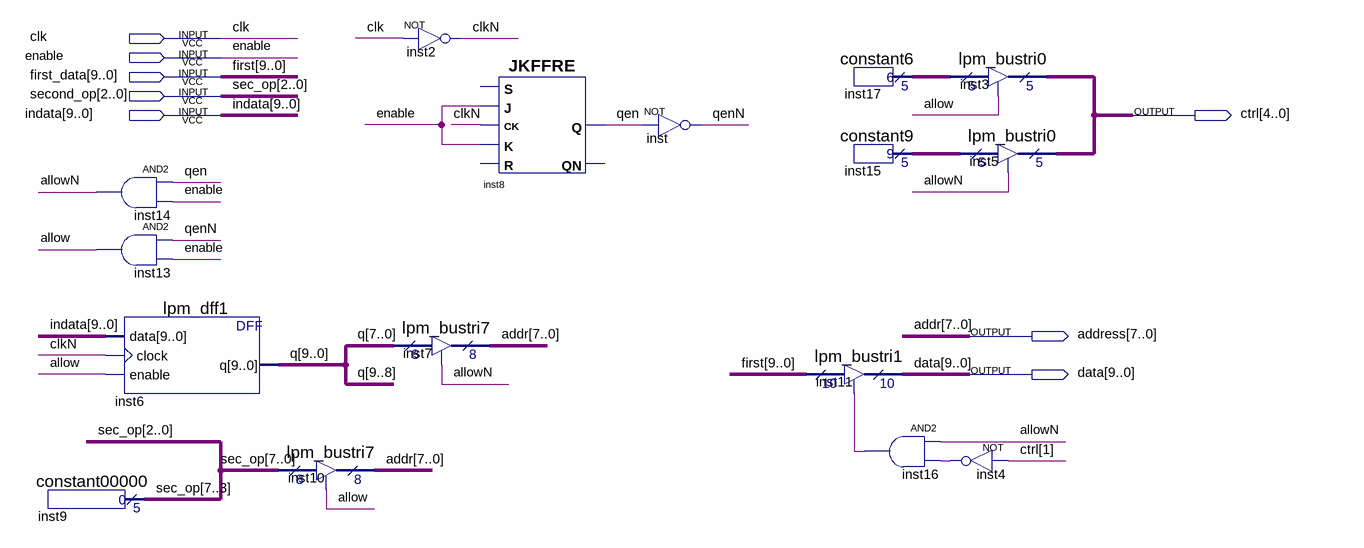
[diagram p0: schematic sheet]
// Quartus schematic R-M_exec.bdf as structural Verilog: 16 symbols, 8 pins
module \R-M_exec  (
  input  clk,
  input  enable,
  input  [9:0] first_data,
  input  [2:0] second_op,
  input  [9:0] indata,
  output [4:0] ctrl,
  output [7:0] address,
  output [9:0] data
);

  wire allow, allowN, clkN, inst4_out, inst16_out, qen, qenN;
  wire [4:0] inst15_result, inst17_result;
  wire [7:3] sec_op;
  wire [9:0] q;

  constant00000 inst9 (.result(sec_op));
  and inst14 (allowN, qen, enable);
  and inst13 (allow, qenN, enable);
  lpm_dff1 inst6 (.data(indata), .clock(clkN), .enable(allow), .q(q));
  lpm_bustri7 inst10 (.enabledt(allow), .data({sec_op, second_op}), .tridata(address));
  lpm_bustri7 inst7 (.enabledt(allowN), .data(q[7:0]), .tridata(address));
  not inst2 (clkN, clk);
  JKFFRE inst8 (.K(enable), .CK(clkN), .J(enable), .Q(qen));  // open: R, S, QN
  not inst (qenN, qen);
  constant6 inst17 (.result(inst17_result));
  constant9 inst15 (.result(inst15_result));
  lpm_bustri1 inst11 (.enabledt(inst16_out), .data(first_data), .tridata(data));
  and inst16 (inst16_out, allowN, inst4_out);
  lpm_bustri0 inst3 (.enabledt(allow), .data(inst17_result), .tridata(ctrl));
  lpm_bustri0 inst5 (.enabledt(allowN), .data(inst15_result), .tridata(ctrl));
  not inst4 (inst4_out, ctrl[1]);

  // Other names for the same wires on the sheet: addr[7:0] = address; first[9:0] = first_data;
  //   sec_op[2:0] = second_op
endmodule
